# EAGLE schematic MOSFET GPIO Switching (EAGLE 9.3.2)
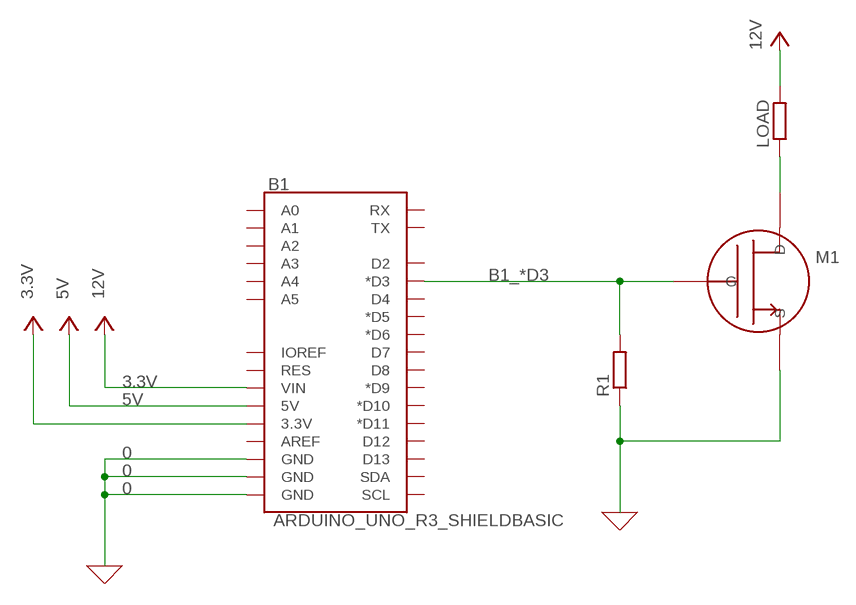
[diagram p0: schematic, sheet 1]

## Parts
B1  ARDUINO_UNO_R3_SHIELDBASIC  [UNO_R3_SHIELD]
LOAD  R0207/10  [0207/10]
M1  FET_N  (no package)
R1  R0207/10  [0207/10]

## Nets
0: B1.GND@0(GND) B1.GND@1(GND) B1.GND@2(GND) M1.S R1.1 ; supply symbol labelled GND
3.3V: B1.VIN ; supply symbol labelled 12V
5V: B1.3.3V B1.5V ; supply symbol labelled 3.3V
B1_*D3: B1.D3(*D3) M1.G R1.2
N$1: LOAD.1 M1.D
VCC: LOAD.2 ; supply symbol labelled 12V
Unconnected: B1.A0 B1.A1 B1.A2 B1.A3 B1.A4 B1.A5 B1.AREF B1.D2 B1.D4 B1.D5(*D5) B1.D6(*D6) B1.D7 B1.D8 B1.D9(*D9) B1.D10(*D10) B1.D11(*D11) B1.D12 B1.D13 B1.IOREF B1.RES B1.RX B1.SCL B1.SDA B1.TX

## Library data of the parts
B1 = SparkFun-Boards:ARDUINO_UNO_R3_SHIELD: Arduino R3 Shield Footprint Shield form compatible with the Arduino Uno R3. SparkFun Products: MG2639 Cellular Shield <https://www.sparkfun.com/products/13120> MIDI Shield <https://www.sparkfun.com/products/12898> R3 Stackable Headers Kit <https://www.sparkfun.com/products/11417>
LOAD R1 = eagle-ltspice:R: RESISTOR, European symbol; SPICEMODEL: NONE; SPICEPREFIX: R
M1 = ngspice-simulation:FET_N: N-Type MOS Field Effect Transistor (MOSFET)